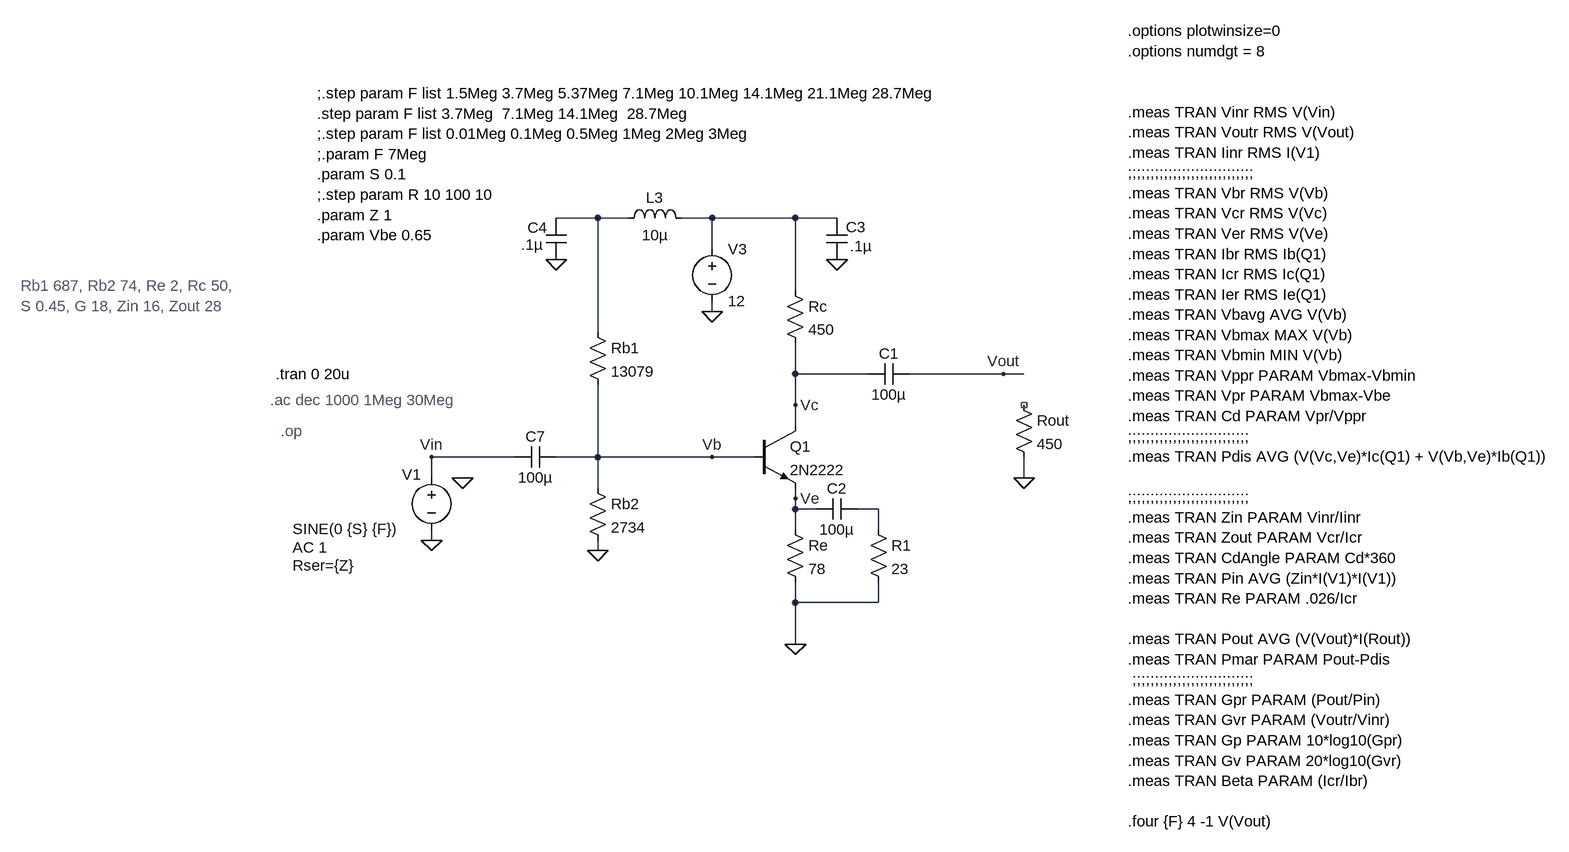
[diagram p0: schematic 2N2222 testing.asc]
2N2222 testing.asc, the LTspice schematic file:
Version 4
SHEET 1 2128 1496
WIRE 112 -176 48 -176
WIRE 160 -176 112 -176
WIRE 288 -176 240 -176
WIRE 416 -176 288 -176
WIRE 480 -176 416 -176
WIRE 288 -128 288 -176
WIRE 416 -64 416 -176
WIRE 288 -32 288 -48
WIRE 112 0 112 -176
WIRE 416 64 416 16
WIRE 528 64 416 64
WIRE 736 64 592 64
WIRE 768 64 736 64
WIRE 416 112 416 64
WIRE 416 144 416 112
WIRE -16 192 -144 192
WIRE 112 192 112 80
WIRE 112 192 48 192
WIRE 288 192 112 192
WIRE 352 192 288 192
WIRE -144 224 -144 192
WIRE 768 224 768 192
WIRE 112 240 112 192
WIRE 416 256 416 240
WIRE 416 272 416 256
WIRE 448 272 416 272
WIRE 544 272 512 272
WIRE 416 304 416 272
WIRE 544 304 544 272
WIRE -144 320 -144 304
WIRE 112 336 112 320
WIRE 416 416 416 384
WIRE 544 416 544 384
WIRE 544 416 416 416
WIRE 416 480 416 416
FLAG -144 320 0
FLAG 112 336 0
FLAG 416 480 0
FLAG 736 64 Vout
FLAG 768 224 0
FLAG 288 192 Vb
FLAG 416 256 Ve
FLAG -144 192 Vin
FLAG 416 112 Vc
FLAG 288 -32 0
FLAG 48 -112 0
FLAG 480 -112 0
FLAG -96 224 0
SYMBOL voltage -144 208 R0
WINDOW 0 -45 11 Left 2
WINDOW 3 -214 95 Left 2
WINDOW 123 -214 123 Left 2
WINDOW 39 -214 151 Left 2
SYMATTR InstName V1
SYMATTR Value SINE(0 {S} {F})
SYMATTR Value2 AC 1
SYMATTR SpiceLine Rser={Z}
SYMBOL res 96 -16 R0
SYMATTR InstName Rb1
SYMATTR Value 13079
SYMBOL res 96 224 R0
SYMATTR InstName Rb2
SYMATTR Value 2734
SYMBOL res 400 288 R0
SYMATTR InstName Re
SYMATTR Value 78
SYMBOL res 752 96 R0
SYMATTR InstName Rout
SYMATTR Value 450
SYMBOL cap 48 176 R90
WINDOW 0 0 32 VBottom 2
WINDOW 3 32 32 VTop 2
SYMATTR InstName C7
SYMATTR Value 100µ
SYMBOL npn 352 144 R0
SYMATTR InstName Q1
SYMATTR Value 2N2222
SYMBOL voltage 288 -144 R0
WINDOW 123 0 0 Left 0
WINDOW 39 0 0 Left 0
SYMATTR InstName V3
SYMATTR Value 12
SYMBOL cap 592 48 R90
WINDOW 0 0 32 VBottom 2
WINDOW 3 32 32 VTop 2
SYMATTR InstName C1
SYMATTR Value 100µ
SYMBOL cap 512 256 R90
WINDOW 0 0 32 VBottom 2
WINDOW 3 32 32 VTop 2
SYMATTR InstName C2
SYMATTR Value 100µ
SYMBOL res 400 -80 R0
SYMATTR InstName Rc
SYMATTR Value 450
SYMBOL ind 144 -160 R270
WINDOW 0 32 56 VTop 2
WINDOW 3 5 56 VBottom 2
SYMATTR InstName L3
SYMATTR Value 10µ
SYMBOL cap 32 -176 R0
WINDOW 0 -28 15 Left 2
WINDOW 3 -38 41 Left 2
SYMATTR InstName C4
SYMATTR Value .1µ
SYMBOL cap 464 -176 R0
WINDOW 0 30 14 Left 2
WINDOW 3 36 43 Left 2
SYMATTR InstName C3
SYMATTR Value .1µ
SYMBOL res 528 288 R0
SYMATTR InstName R1
SYMATTR Value 23
TEXT -384 64 Left 2 !.tran 0 20u
TEXT 928 -464 Left 2 !.options plotwinsize=0\n.options numdgt = 8\n \n \n.meas TRAN Vinr RMS V(Vin)\n.meas TRAN Voutr RMS V(Vout)\n.meas TRAN Iinr RMS I(V1)\n;;;;;;;;;;;;;;;;;;;;;;;;;;;;\n.meas TRAN Vbr RMS V(Vb)\n.meas TRAN Vcr RMS V(Vc)\n.meas TRAN Ver RMS V(Ve)\n.meas TRAN Ibr RMS Ib(Q1)\n.meas TRAN Icr RMS Ic(Q1)\n.meas TRAN Ier RMS Ie(Q1)\n.meas TRAN Vbavg AVG V(Vb)\n.meas TRAN Vbmax MAX V(Vb)\n.meas TRAN Vbmin MIN V(Vb)\n.meas TRAN Vppr PARAM Vbmax-Vbmin\n.meas TRAN Vpr PARAM Vbmax-Vbe\n.meas TRAN Cd PARAM Vpr/Vppr\n;;;;;;;;;;;;;;;;;;;;;;;;;;;\n.meas TRAN Pdis AVG (V(Vc,Ve)*Ic(Q1) + V(Vb,Ve)*Ib(Q1))\n \n;;;;;;;;;;;;;;;;;;;;;;;;;;;\n.meas TRAN Zin PARAM Vinr/Iinr\n.meas TRAN Zout PARAM Vcr/Icr\n.meas TRAN CdAngle PARAM Cd*360\n.meas TRAN Pin AVG (Zin*I(V1)*I(V1))\n.meas TRAN Re PARAM .026/Icr\n \n.meas TRAN Pout AVG (V(Vout)*I(Rout))\n.meas TRAN Pmar PARAM Pout-Pdis\n ;;;;;;;;;;;;;;;;;;;;;;;;;;;\n.meas TRAN Gpr PARAM (Pout/Pin)\n.meas TRAN Gvr PARAM (Voutr/Vinr)\n.meas TRAN Gp PARAM 10*log10(Gpr)\n.meas TRAN Gv PARAM 20*log10(Gvr)\n.meas TRAN Beta PARAM (Icr/Ibr)\n \n.four {F} 4 -1 V(Vout)
TEXT -320 -368 Left 2 !;.step param F list 1.5Meg 3.7Meg 5.37Meg 7.1Meg 10.1Meg 14.1Meg 21.1Meg 28.7Meg\n.step param F list 3.7Meg  7.1Meg 14.1Meg  28.7Meg\n;.step param F list 0.01Meg 0.1Meg 0.5Meg 1Meg 2Meg 3Meg\n;.param F 7Meg\n.param S 0.1\n;.step param R 10 100 10\n.param Z 1\n.param Vbe 0.65
TEXT -392 104 Left 2 ;.ac dec 1000 1Meg 30Meg
TEXT -776 -72 Left 2 ;Rb1 687, Rb2 74, Re 2, Rc 50, \nS 0.45, G 18, Zin 16, Zout 28
TEXT -376 152 Left 2 ;.op

The netlist it stands for:
* 2N2222 testing.asc
V1 Vin 0 SINE(0 {S} {F}) AC 1 Rser={Z}
Rb1 N001 Vb 13079
Rb2 Vb 0 2734
Re Ve 0 78
Rout NC_01 0 450
C7 Vb Vin 100µ
Q1 Vc Vb Ve 0 2N2222
V3 N002 0 12
C1 Vout Vc 100µ
C2 N003 Ve 100µ
Rc N002 Vc 450
L3 N001 N002 10µ
C4 N001 0 .1µ
C3 N002 0 .1µ
R1 N003 0 23
.model NPN NPN
.model PNP PNP
.lib standard.bjt
.tran 0 20u
.options plotwinsize=0
.options numdgt = 8
.meas TRAN Vinr RMS V(Vin)
.meas TRAN Voutr RMS V(Vout)
.meas TRAN Iinr RMS I(V1)
;;;;;;;;;;;;;;;;;;;;;;;;;;;;
.meas TRAN Vbr RMS V(Vb)
.meas TRAN Vcr RMS V(Vc)
.meas TRAN Ver RMS V(Ve)
.meas TRAN Ibr RMS Ib(Q1)
.meas TRAN Icr RMS Ic(Q1)
.meas TRAN Ier RMS Ie(Q1)
.meas TRAN Vbavg AVG V(Vb)
.meas TRAN Vbmax MAX V(Vb)
.meas TRAN Vbmin MIN V(Vb)
.meas TRAN Vppr PARAM Vbmax-Vbmin
.meas TRAN Vpr PARAM Vbmax-Vbe
.meas TRAN Cd PARAM Vpr/Vppr
;;;;;;;;;;;;;;;;;;;;;;;;;;;
.meas TRAN Pdis AVG (V(Vc,Ve)*Ic(Q1) + V(Vb,Ve)*Ib(Q1))
;;;;;;;;;;;;;;;;;;;;;;;;;;;
.meas TRAN Zin PARAM Vinr/Iinr
.meas TRAN Zout PARAM Vcr/Icr
.meas TRAN CdAngle PARAM Cd*360
.meas TRAN Pin AVG (Zin*I(V1)*I(V1))
.meas TRAN Re PARAM .026/Icr
.meas TRAN Pout AVG (V(Vout)*I(Rout))
.meas TRAN Pmar PARAM Pout-Pdis
 ;;;;;;;;;;;;;;;;;;;;;;;;;;;
.meas TRAN Gpr PARAM (Pout/Pin)
.meas TRAN Gvr PARAM (Voutr/Vinr)
.meas TRAN Gp PARAM 10*log10(Gpr)
.meas TRAN Gv PARAM 20*log10(Gvr)
.meas TRAN Beta PARAM (Icr/Ibr)
.four {F} 4 -1 V(Vout)
;.step param F list 1.5Meg 3.7Meg 5.37Meg 7.1Meg 10.1Meg 14.1Meg 21.1Meg 28.7Meg
.step param F list 3.7Meg  7.1Meg 14.1Meg  28.7Meg
;.step param F list 0.01Meg 0.1Meg 0.5Meg 1Meg 2Meg 3Meg
;.param F 7Meg
.param S 0.1
;.step param R 10 100 10
.param Z 1
.param Vbe 0.65
* .ac dec 1000 1Meg 30Meg
* Rb1 687, Rb2 74, Re 2, Rc 50,
* S 0.45, G 18, Zin 16, Zout 28
* .op
.backanno
.end